# Altium schematic sheet Memory.SchDoc: SRAM & FLASH & SDRAM
size A4; DocumentNumber: MB1167; Revision: B.1; SheetNumber: 4; SheetTotal: 17; Project: STM327x6G-EVAL
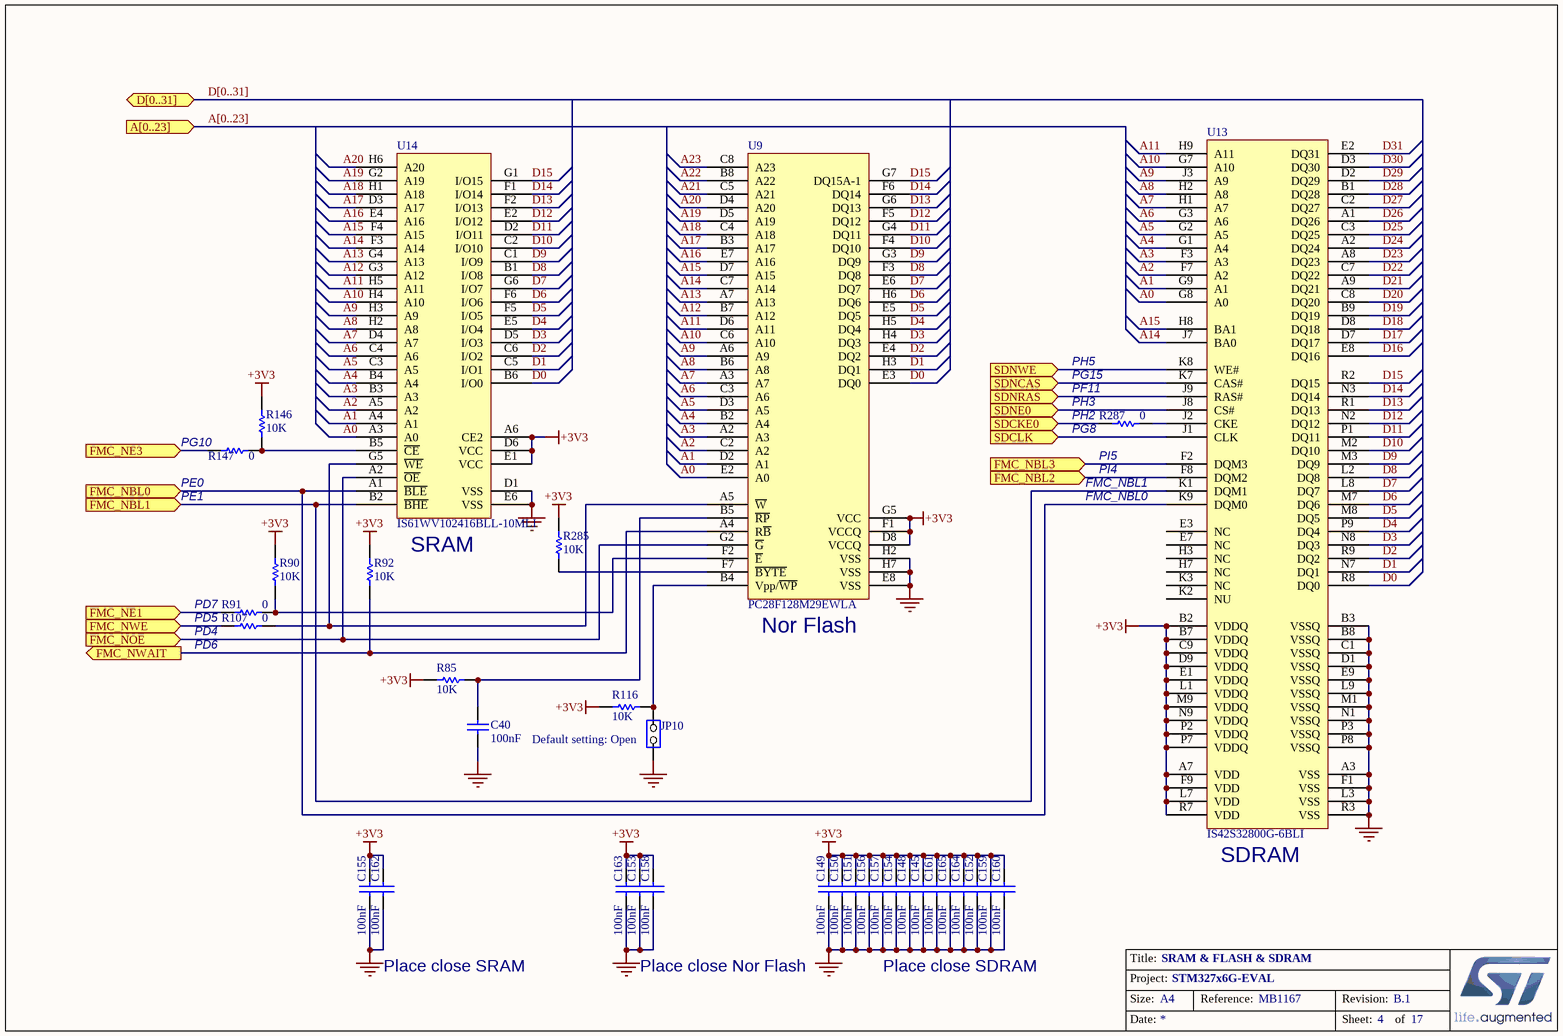
[diagram p0: Memory.SchDoc]

## Parts
C40  100nF  [0603C]
C145  100nF  [0603C]
C148  100nF  [0603C]
C149  100nF  [0603C]
C150  100nF  [0603C]
C151  100nF  [0603C]
C152  100nF  [0603C]
C153  100nF  [0603C]
C154  100nF  [0603C]
C155  100nF  [0603C]
C156  100nF  [0603C]
C157  100nF  [0603C]
C158  100nF  [0603C]
C159  100nF  [0603C]
C160  100nF  [0603C]
C161  100nF  [0603C]
C162  100nF  [0603C]
C163  100nF  [0603C]
C164  100nF  [0603C]
C165  100nF  [0603C]
JP10  (no value)  [SIP2]
R85  10K  [0603R]
R90  10K  [0603R]
R91  0  [0603R]
R92  10K  [0603R]
R107  0  [0603R]
R116  10K  [0603R]
R146  10K  [0603R]
R147  0  [0603R]
R285  10K  [0603R]
R287  0  [0603R]
U9  PC28F128M29EWLA  [FBGA64_1_11X13]
U13  IS42S32800G-6BLI  [FBGA90_0R8_8X13]
U14  IS61WV102416BLL-10MLI  [BGA48_0R75_9X11]

## Ports
A[0..23] (in), D[0..31] (bidir), FMC_NBL0 (in), FMC_NBL1 (in), FMC_NBL2 (in), FMC_NBL3 (in), FMC_NE1 (in), FMC_NE3 (in), FMC_NOE (in), FMC_NWAIT (out), FMC_NWE (in), SDCKE0 (in), SDCLK (in), SDNCAS (in), SDNE0 (in), SDNRAS (in), SDNWE (in)

## Nets
+3V3: C145.1 C148.1 C149.1 C150.1 C151.1 C152.1 C153.1 C154.1 C155.1 C156.1 C157.1 C158.1 C159.1 C160.1 C161.1 C162.1 C163.1 C164.1 C165.1 R85.1 R90.2 R92.2 R116.2 R146.2 R285.2 U9.D8(VCCQ) U9.F1(VCCQ) U9.G5(VCC) U13.A7(VDD) U13.B2(VDDQ) U13.B7(VDDQ) U13.C9(VDDQ) U13.D9(VDDQ) U13.E1(VDDQ) U13.F9(VDD) U13.L1(VDDQ) U13.L7(VDD) U13.M9(VDDQ) U13.N9(VDDQ) U13.P2(VDDQ) U13.P7(VDDQ) U13.R7(VDD) U14.A6(CE2) U14.D6(VCC) U14.E1(VCC)
GND: C40.2 C145.2 C148.2 C149.2 C150.2 C151.2 C152.2 C153.2 C154.2 C155.2 C156.2 C157.2 C158.2 C159.2 C160.2 C161.2 C162.2 C163.2 C164.2 C165.2 JP10.1(COMMON) U9.E8(VSS) U9.H2(VSS) U9.H7(VSS) U13.A3(VSS) U13.B3(VSSQ) U13.B8(VSSQ) U13.C1(VSSQ) U13.D1(VSSQ) U13.E9(VSSQ) U13.F1(VSS) U13.L3(VSS) U13.L9(VSSQ) U13.M1(VSSQ) U13.N1(VSSQ) U13.P3(VSSQ) U13.P8(VSSQ) U13.R3(VSS) U14.D1(VSS) U14.E6(VSS)
A0: U9.E2(A0) U13.G8(A0) U14.A3(A0)
A1: U9.D2(A1) U13.G9(A1) U14.A4(A1)
A2: U9.C2(A2) U13.F7(A2) U14.A5(A2)
A3: U9.A2(A3) U13.F3(A3) U14.B3(A3)
A4: U9.B2(A4) U13.G1(A4) U14.B4(A4)
A5: U9.D3(A5) U13.G2(A5) U14.C3(A5)
A6: U9.C3(A6) U13.G3(A6) U14.C4(A6)
A7: U9.A3(A7) U13.H1(A7) U14.D4(A7)
A8: U9.B6(A8) U13.H2(A8) U14.H2(A8)
A9: U9.A6(A9) U13.J3(A9) U14.H3(A9)
A10: U9.C6(A10) U13.G7(A10) U14.H4(A10)
A11: U9.D6(A11) U13.H9(A11) U14.H5(A11)
A12: U9.B7(A12) U14.G3(A12)
A13: U9.A7(A13) U14.G4(A13)
A14: U9.C7(A14) U13.J7(BA0) U14.F3(A14)
A15: U9.D7(A15) U13.H8(BA1) U14.F4(A15)
A16: U9.E7(A16) U14.E4(A16)
A17: U9.B3(A17) U14.D3(A17)
A18: U9.C4(A18) U14.H1(A18)
A19: U9.D5(A19) U14.G2(A19)
A20: U9.D4(A20) U14.H6(A20)
A21: U9.C5(A21)
A22: U9.B8(A22)
A23: U9.C8(A23)
D0: U9.E3(DQ0) U13.R8(DQ0) U14.B6(I/O0)
D1: U9.H3(DQ1) U13.N7(DQ1) U14.C5(I/O1)
D2: U9.E4(DQ2) U13.R9(DQ2) U14.C6(I/O2)
D3: U9.H4(DQ3) U13.N8(DQ3) U14.D5(I/O3)
D4: U9.H5(DQ4) U13.P9(DQ4) U14.E5(I/O4)
D5: U9.E5(DQ5) U13.M8(DQ5) U14.F5(I/O5)
D6: U9.H6(DQ6) U13.M7(DQ6) U14.F6(I/O6)
D7: U9.E6(DQ7) U13.L8(DQ7) U14.G6(I/O7)
D8: U9.F3(DQ8) U13.L2(DQ8) U14.B1(I/O8)
D9: U9.G3(DQ9) U13.M3(DQ9) U14.C1(I/O9)
D10: U9.F4(DQ10) U13.M2(DQ10) U14.C2(I/O10)
D11: U9.G4(DQ11) U13.P1(DQ11) U14.D2(I/O11)
D12: U9.F5(DQ12) U13.N2(DQ12) U14.E2(I/O12)
D13: U9.G6(DQ13) U13.R1(DQ13) U14.F2(I/O13)
D14: U9.F6(DQ14) U13.N3(DQ14) U14.F1(I/O14)
D15: U9.G7(DQ15A-1) U13.R2(DQ15) U14.G1(I/O15)
D16: U13.E8(DQ16)
D17: U13.D7(DQ17)
D18: U13.D8(DQ18)
D19: U13.B9(DQ19)
D20: U13.C8(DQ20)
D21: U13.A9(DQ21)
D22: U13.C7(DQ22)
D23: U13.A8(DQ23)
D24: U13.A2(DQ24)
D25: U13.C3(DQ25)
D26: U13.A1(DQ26)
D27: U13.C2(DQ27)
D28: U13.B1(DQ28)
D29: U13.D2(DQ29)
D30: U13.D3(DQ30)
D31: U13.E2(DQ31)
FMC_NBL0: U13.K9(DQM0) U14.A1(~{BLE}) ; port FMC_NBL0
FMC_NBL1: U13.K1(DQM1) U14.B2(~{BHE}) ; port FMC_NBL1
FMC_NBL2: U13.F8(DQM2) ; port FMC_NBL2
FMC_NBL3: U13.F2(DQM3) ; port FMC_NBL3
FMC_NE1: R91.2 ; port FMC_NE1
FMC_NE3: R147.2 ; port FMC_NE3
FMC_NOE: U9.G2(~{G}) U14.A2(~{OE}) ; port FMC_NOE
FMC_NWAIT: R92.1 U9.A4(R~{B}) ; port FMC_NWAIT
FMC_NWE: R107.2 ; port FMC_NWE
SDCKE0: R287.2 ; port SDCKE0
SDCLK: U13.J1(CLK) ; port SDCLK
SDNCAS: U13.K7(CAS#) ; port SDNCAS
SDNE0: U13.J8(CS#) ; port SDNE0
SDNRAS: U13.J9(RAS#) ; port SDNRAS
SDNWE: U13.K8(WE#) ; port SDNWE
NetC40_1: C40.1 R85.2 U9.B5(~{RP})
NetJP10_2: JP10.2(NO) R116.1 U9.B4(Vpp/~{WP})
NetR90_1: R90.1 R91.1 U9.F2(~{E})
NetR107_1: R107.1 U9.A5(~{W}) U14.G5(~{WE})
NetR146_1: R146.1 R147.1 U14.B5(~{CE})
NetR285_1: R285.1 U9.F7(~{BYTE})
NetR287_1: R287.1 U13.J2(CKE)

Not connected (* = marked no-connect by the designer): U13 E3(NC) E7(NC) H3(NC) H7(NC) K2(NU) K3(NC)

## Buses and harness runs
bus A[0..23] = port A[0..23]
bus D[0..31] = port D[0..31]

## Notes on the sheet
- PH5
- (near R287) PG15
- (near R147) PG10
- (near R287) PF11
- (near R287) PH3
- (near R287) PH2
- (near R287) PG8
- (near R147) PE1
- (near R147) PE0
- FMC_NBL1
- FMC_NBL0
- (near R287) PI5
- (near R287) PI4
- SRAM
- PD5
- PD7
- PD6
- PD4
- (near U9) Nor Flash
- (near JP10) Default setting: Open
- (near U13) SDRAM
- Place close SRAM
- Place close Nor Flash
- Place close SDRAM
- Title:
- Project:
- Size:
- Date:
- A4
- Reference:
- Sheet:
- Revision:
- of

## Library data of the parts
C40 C145 C148-C165 = Cap: Capacitor; Value: 10nF; Published: 8-Jun-2000; Revision: July-2002: Re-released for DXP Platform.; Publisher: Altium Limited
JP10 = JP2
R85 R90-R92 R107 R116 R146 R147 R285 R287 = Res1: Resistor; Value: 1K; Published: 8-Jun-2000; Revision: July-2002: Re-released for DXP Platform.; Publisher: Altium Limited
U9 = M29W128FL70ZA6E
U13 = MT48LC4M32B2B5